# EAGLE design Me-Motor Driver v2.0 (EAGLE 6.2)
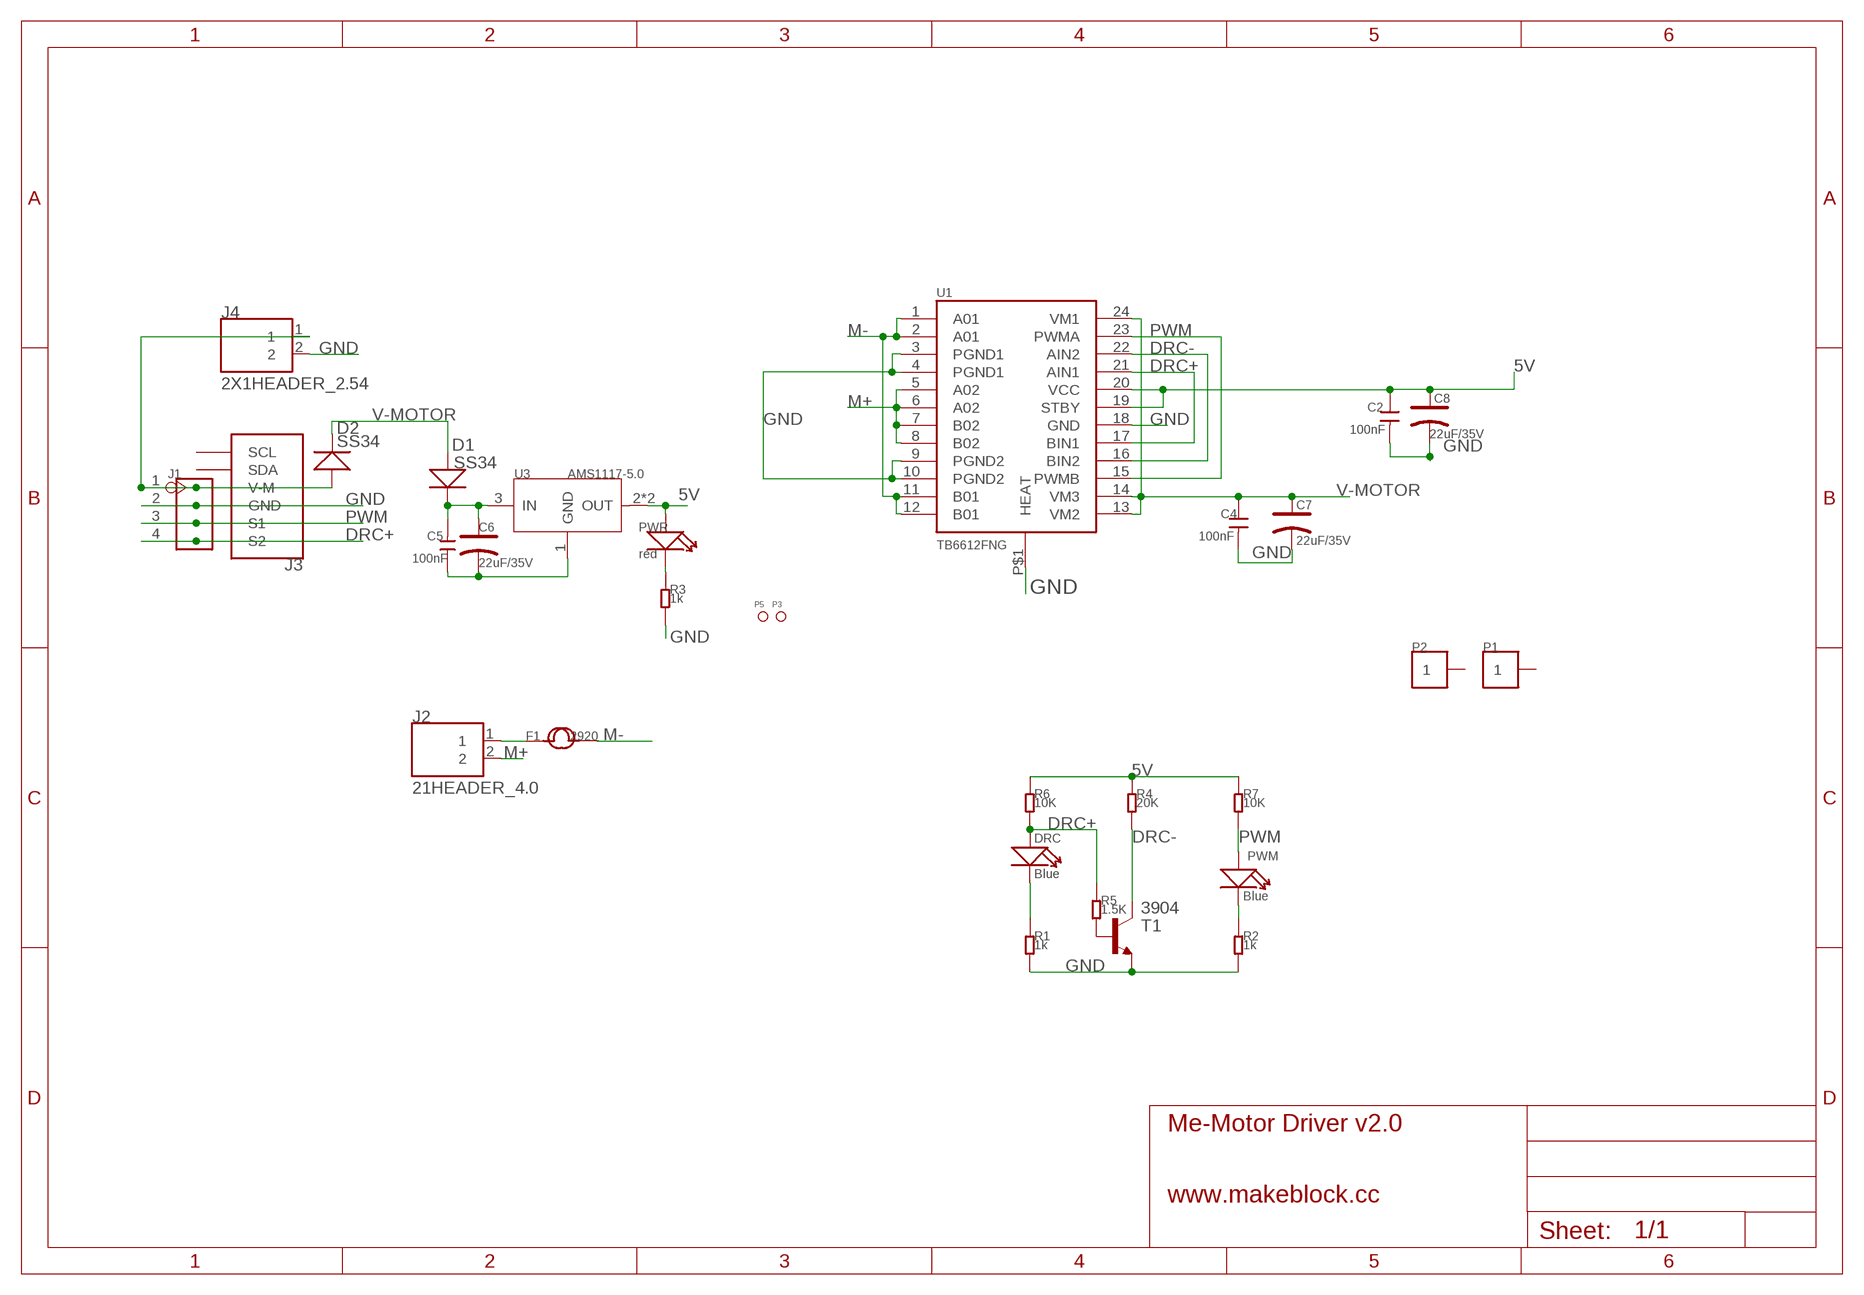
[diagram p0: schematic, sheet 1]

## Parts
C2  100nF  006-C30*35  [0603_S]
C4  100nF  006-C30*35  [0603_S]
C5  100nF  C-0603  [0603]
C6  22uF/35V  CAP-ELECTRO-B  [ELECTRO-SMD-B-4.8MM]
C7  22uF/35V  CAP-ELECTRO-B  [ELECTRO-SMD-B-4.8MM]
C8  22uF/35V  CAP-ELECTRO-B  [ELECTRO-SMD-B-4.8MM]
D1  SS34  D'SMA'  [D2010]
D2  SS34  D'SMA'  [D2010]
DRC  Blue  LED'0603'  [LED-0603]
F1  2920  [2920]
J1  HEADER-4P-60/35MIL  [4P-65/35MIL]
J2  21HEADER_4.0  [2*1HEADER_4.0]
J3  RJ11-6P6C-MOTOR  [RJ11-6P6C]
J4  2X1HEADER_2.54  [2X1HEADER_2.54]
P1  PAD-1P-4MM  [HOLE-01]
P2  PAD-1P-4MM  [HOLE-01]
P3  PAD-MARK  [ROUND-MARK-1.0]
P5  PAD-MARK  [ROUND-MARK-1.0]
PWM  Blue  LED'0603'  [LED-0603]
PWR  red  LED'0603'  [LED-0603]
R1  1k  R-0603  [0603]
R2  1k  R-0603  [0603]
R3  1k  R-0603  [0603]
R4  20K  R-0603  [0603]
R5  1.5K  R-0603  [0603]
R6  10K  R-0603  [0603]
R7  10K  R-0603  [0603]
T1  3904  [3904]
U1  TB6612FNG  [SSOP24]
U3  AMS1117-5.0  LD1117S  [SOT-223]

## Nets
5V: C2.1 C8.+ PWR.+ R4.1 R6.1 R7.1 U1.19(STBY) U1.20(VCC) U3.2(OUT) U3.TER(OUT)
DRC+: DRC.+ J1.4 J3.6(S2) R5.1 R6.2 U1.17(BIN1) U1.21(AIN1)
DRC-: R4.2 T1.3(C) U1.16(BIN2) U1.22(AIN2)
GND: C2.2 C4.2 C5.1 C6.- C7.- C8.- J1.2 J3.4(GND) J4.2 R1.2 R2.2 R3.2 T1.2(E) U1.3(PGND1) U1.4(PGND1) U1.9(PGND2) U1.10(PGND2) U1.18(GND) U1.P$1(HEAT) U3.1(GND)
M+: J2.2 U1.5(A02) U1.6(A02) U1.7(B02) U1.8(B02)
M-: F1.2 U1.1(A01) U1.2(A01) U1.11(B01) U1.12(B01)
N$1: DRC.- R1.1
N$2: F1.1 J2.1
N$3: PWM.- R2.1
N$4: R5.2 T1.1(B)
N$5: PWR.- R3.1
N$6: C5.2 C6.+ D1.- U3.3(IN)
POWER: D2.+ J1.1 J3.3(V-M) J4.1
PWM: J1.3 J3.5(S1) PWM.+ R7.2 U1.15(PWMB) U1.23(PWMA)
V-MOTOR: C4.1 C7.+ D1.+ D2.- U1.13(VM2) U1.14(VM3) U1.24(VM1)
Unconnected: J3.1(SCL) J3.2(SDA) P1.1 P2.1

## Notes on the sheet
- www.makeblock.cc

## Library data of the parts
C2 C4 = Discrete:006-C*: Ceramic Capacitors
C5 = Discrete:C*: Ceramic Capacitors
C6-C8 = Discrete:CAP*: Electrolytic Capacitors,Tantalum Capacitors and Super Capacitors
D1 D2 = Discrete:D*
DRC PWM PWR = Discrete:LED*
F1 = Makeblock:2920
J1 = Connector:HEADER-4P
J2 = Makeblock:2*1HEADER_4.0
J3 = Makeblock:RJ11-6P6C-MOTOR
J4 = Makeblock:2X1HEADER_2.54
P1 P2 = Makeblock:PAD-1P*
P3 P5 = Discrete:PAD-MARK; PARTNO: DNP
R1-R7 = Discrete:R*
T1 = Makeblock:3904
U1 = SparkFun-PowerIC:TB6612FNG: Toshiba 1A dual motor driver
U3 = IC:LD1117: Low Drop Fixed And Adjustable Positive Voltage Regulators http://www.datasheetcatalog.org/datasheet/SGSThomsonMicroelectronics/mXuqtqv.pdf

## Board
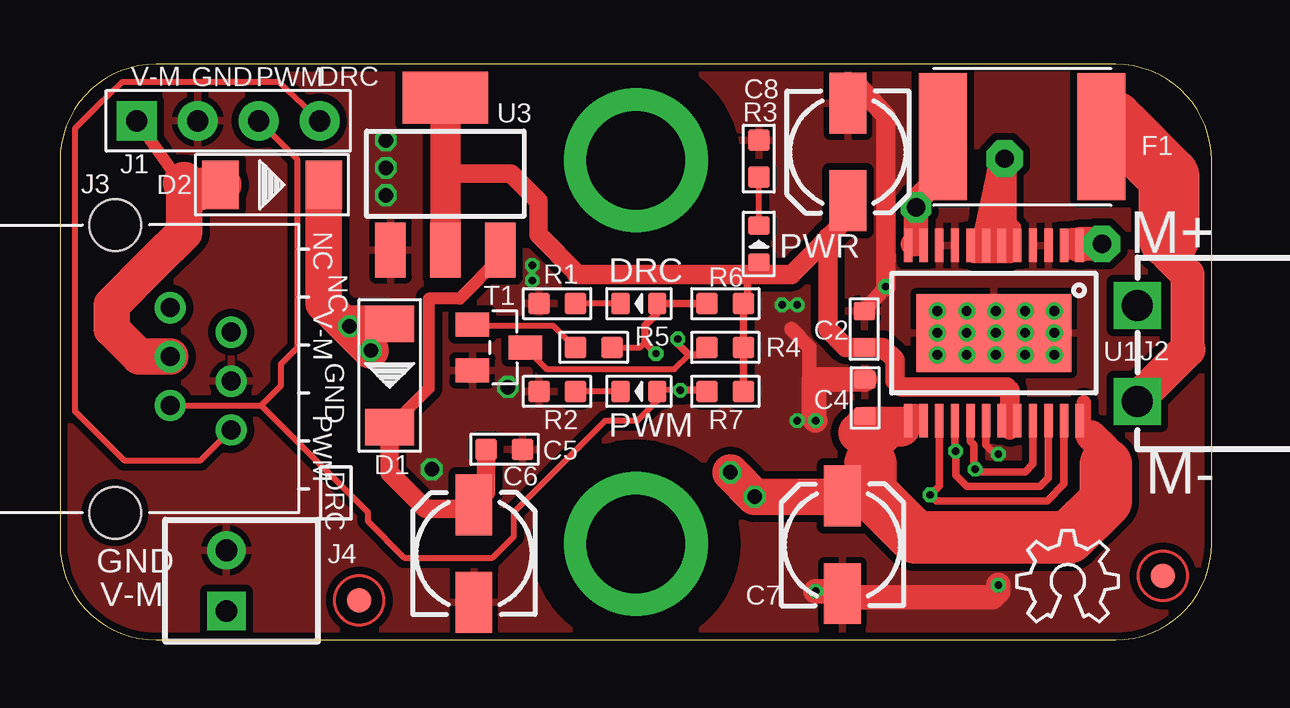
[diagram p1: board, top side]
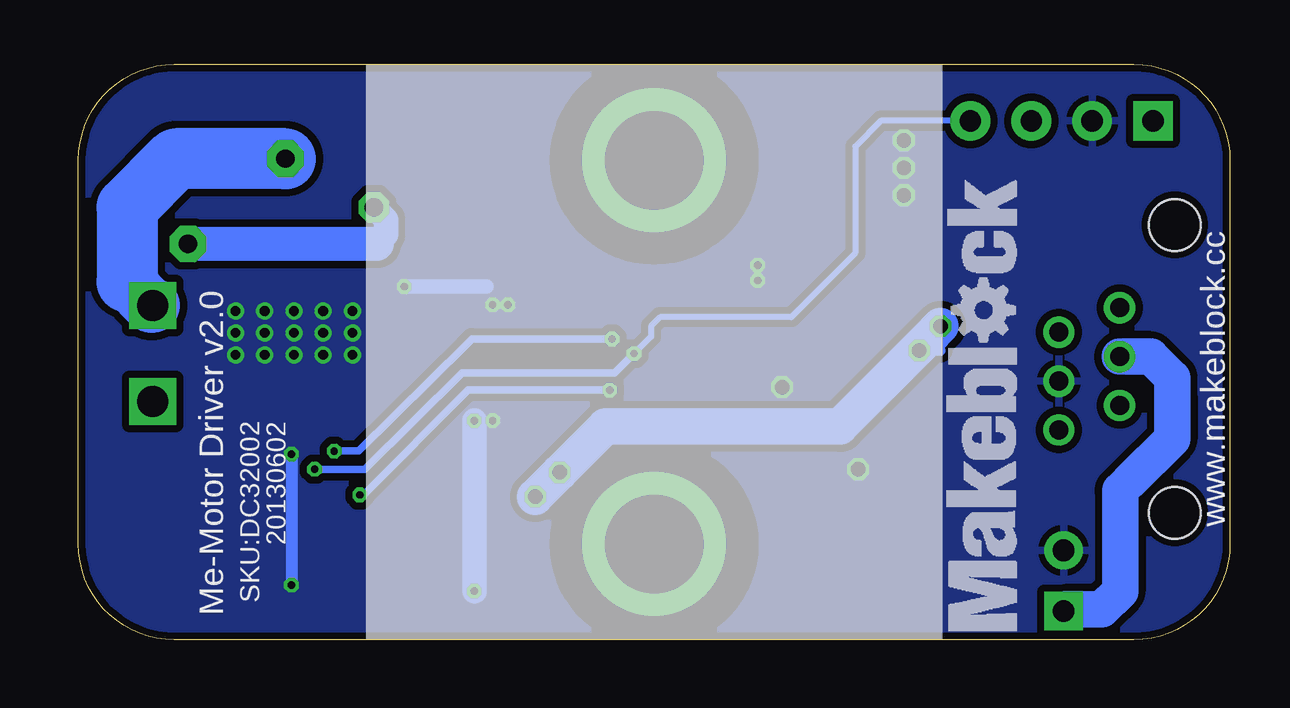
[diagram p2: board, bottom side, seen from below]

Size 48 x 24 mm. Coordinates in mm from the lower left corner, seen from the top.
Outline: 0,20 0,4 arc90 4,0 44,0 arc90 48,4 48,20 arc90 44,24 4,24 arc90 0,20
Copper layers (1*16): Top 0.035mm / dielectric 1.5mm / Bottom 0.035mm
Design rules: minimum track width 6mil, minimum drill 12mil, track to track 8mil, track to pad 8mil, pad to pad 8mil, via to via 8mil, smd to smd 0mil, copper to edge 10mil, drill to drill 10mil, minimum pad ring 10mil, minimum via ring 6mil, stop-mask expansion 2mil, vias tented up to drill 100mil, thermal gap 10mil

### Footprints (pad centres in the part's own frame; a part is rotated, then mirrored left to right if it is on the bottom)
0603_S = smd 0.762 x 0.889: 1 -0.762,0; 2 0.762,0
0603 = smd 0.889 x 0.889: 1 -0.762,0; 2 0.762,0
ELECTRO-SMD-B-4.8MM = smd 2.54 x 1.524: + 2.032,0; - -2.032,0
D2010 = smd 1.524 x 2.032: + -2.159,0; - 2.159,0
LED-0603 = smd 0.762 x 0.889: + -0.762,0; - 0.762,0
2920 = smd 2 x 5.3: 1 -3.3,0; 2 3.3,0
4P-65/35MIL = drill 0.889 pad 1.651 square: 1 0,3.81 | drill 0.889 pad 1.651: 2 0,1.27; 3 0,-1.27; 4 0,-3.81
2*1HEADER_4.0 = drill 1.3 pad 1.95 square: 1 0,-4; 2 0,0
RJ11-6P6C = drill 0.8: 1 -2.55,1.8; 2 -1.53,4.34; 3 -0.51,1.8; 4 0.51,4.34; 5 1.53,1.8; 6 2.55,4.34 | hole 2.15: -6,-0.5; 6,-0.5
2X1HEADER_2.54 = drill 0.9 pad 1.6 square: 1 0,-2.54 | drill 0.9 pad 1.6: 2 0,0
HOLE-01 = drill 4.1 pad 6: 1 0,0
ROUND-MARK-1.0 = smd 1.016 x 1.016: P$1 0,0
3904 = smd 1 x 1.4: 1 -0.95,-1.1; 2 0.95,-1.1; 3 0,1.1
SSOP24 = smd 0.348 x 1.397: 1 -3.575,-3.656; 2 -2.925,-3.656; 3 -2.275,-3.656; 4 -1.625,-3.656; 5 -0.975,-3.656; 6 -0.325,-3.656; 7 0.325,-3.656; 8 0.975,-3.656; 9 1.625,-3.656; 10 2.275,-3.656; 11 2.925,-3.656; 12 3.575,-3.656; 13 3.575,3.656; 14 2.925,3.656; 15 2.275,3.656; 16 1.625,3.656; 17 0.975,3.656; 18 0.325,3.656; 19 -0.325,3.656; 20 -0.975,3.656; 21 -1.625,3.656; 22 -2.275,3.656; 23 -2.925,3.656; 24 -3.575,3.656 | smd 6.452 x 3.251: P$1 0,0
SOT-223 = smd 1.27 x 2.286: 1 -2.286,-3.175; 2 0,-3.175; 3 2.286,-3.175 | smd 3.556 x 2.159: TER 0,3.175

### Placement (x,y rotation side)
C2  33.53,12.95 90 top
C4  33.55,10.09 90 top
C5  18.53,7.95 180 top
C6  17.26,3.6 90 top
C7  32.61,3.96 90 top
C8  32.84,20.35 270 top
D1  13.74,11.02 270 top
D2  8.84,18.97 0 top
DRC  24.13,14.02 180 top
F1  40.11,20.98 180 top
J1  7.01,21.64 90 top
J2  44.91,13.94 0 top
J3  2.79,11.3 270 top
J4  6.93,3.73 0 top
P1  24,20 0 top
P2  24,4 0 top
P3  45.97,2.67 0 top
P5  12.47,1.65 0 top
PWM  24.13,10.36 180 top
PWR  29.13,16.51 90 top
R1  20.73,14.02 180 top
R2  20.73,10.36 180 top
R3  29.13,20.07 90 top
R4  27.74,12.19 180 top
R5  22.25,12.19 180 top
R6  27.74,14.02 180 top
R7  27.74,10.36 180 top
T1  18.29,12.19 270 top
U1  38.93,12.79 180 top
U3  16.07,19.44 0 top
U$1  [OSHW_6X150_NOTEXT]  39.88,0.76 0 top
U$2  [LOGO-3/2]  8.88,0.36 90 bottom

### Tracks (layer width: path | path; a pad name or v marks a point on that pad's centre or on a via)
5V
  Top 0.254: 32,16.79 32,17.07 32.84,17.91 | PWR.+ 28.93,15.34 28.83,15.24
  Top 0.305: U1.20 39.9,9.06 39.6,8.76 39.6,8.79 U1.19 | R7.1 R4.1 R6.1 28.65,14.17 28.65,15.24
  Top 0.406: 27.56,15.12 27.69,15.24
  Top 0.762: 21.54,15.24 21.54,15.29 19.94,16.89 19.94,18.29 18.8,19.43 16.07,19.43
  Top 0.813: 39.6,8.76 39.6,10.41 39.47,10.54 35.08,10.54 34.8,10.82 34.8,11.68 34.29,12.19 C2.1 32.77,12.19 32,12.95 32,16.79 | 21.54,15.24 27.69,15.24 28.65,15.24 28.83,15.24 30.48,15.24 32.84,17.6 32.84,17.91 C8.+
  Top 1.27: U3.2 16.07,19.43 U3.TER
DRC+  (via drill 0.3)
  Top 0.254: R5.1 24.18,12.19 24.38,12.39 | J1.4 9.09,23.27 2.62,23.27 1.52,22.23 0.64,21.34 0.64,9.53 0.76,9.4 0.89,9.27 1.02,9.14 2.67,7.49 5.87,7.49 J3.6
  Top 0.305: U1.17 37.95,8.28 38.1,8.13 38.1,7.37 | 38.1,7.37 v38.15,7.11 | U1.21 40.55,7.33 40.23,7.01 38.41,7.01 38.1,7.32 38.1,7.37 | R6.2 DRC.+ 24.89,13.61 24.38,13.11 24.38,12.39 v24.84,11.94
  Bottom 0.254: 24.71,11.81 v24.84,11.94 24.13,12.65 24.13,13.08 23.75,13.46 18.29,13.46 15.62,16.13 15.62,20.57 14.55,21.64 J1.4
  Bottom 0.305: v38.15,7.11 36.07,7.11 32,11.12 25.65,11.12 v24.84,11.94
DRC-  (via drill 0.3)
  Top 0.254: 26.21,11.89 25.6,11.28 20.3,11.28 T1.3
  Top 0.305: U1.16 37.3,7.91 v37.34,7.87 37.34,6.86 37.8,6.4 40.84,6.4 41.2,6.76 U1.22 | R4.2 26.67,11.89 26.21,11.89 25.76,12.34 v25.76,12.55
  Bottom 0.305: v37.34,7.87 36.32,7.87 31.83,12.32 31.6,12.55 v25.76,12.55
GND  (via drill 0.3, 0.41, 0.6)
  Top 0.305: U1.18 38.6,8.13 39.12,7.62 | 31.24,12.19 31.24,9.4 v31.5,9.14
  Top 0.61: C2.2 v34.42,14.73 | 30.48,12.95 31.24,12.19 31.24,10.92 31.43,10.86
  Top 0.813: 33.27,23.11 34.42,21.84 v34.42,14.73
  Top 1.016: v39.12,2.29 39.12,2.03 38.86,1.78 33.4,1.78 | C4.2 31.43,10.86 31.43,9.21 v31.5,9.14 | v31.5,2.03 32.89,2.03
  Bottom 0.508: 39.12,7.62 v39.12,2.29
  Bottom 0.61: v34.42,14.73 30.99,14.73
  Bottom 1.016: v31.5,9.14 v31.5,2.03
  other vias: 36.58,13.72 36.58,12.8 36.58,11.89 37.8,13.72 39.01,13.72 40.23,13.72 41.45,13.72 37.8,12.8 37.8,11.89 39.01,12.8 39.01,11.89 40.23,11.89 40.23,12.8 41.45,12.8 41.45,11.89 39.12,7.75 13.59,20.83 13.59,19.68 13.59,18.54 15.49,7.11 18.67,10.54 30.73,9.14 19.68,14.99 19.68,15.62 30.73,13.97 30.1,13.97
  pour Top (isolate 0.305): 0,24.08 48.16,24.08 48.16,0 0,0
  pour Bottom (isolate 0.305): 0,24.08 47.85,24.08 47.85,0 0,0
M+  (via drill 0.76 pad 1.52)
  Top 0.305: U1.8 37.95,16.15 38.1,16 | U1.6 U1.5 39.9,17.25 39.62,17.53 39.37,17.27
  Top 0.61: 38.1,16 39.62,16 39.62,16.51 39.62,16.89 | U1.7 U1.6
  Top 0.813: v39.37,20.07 39.37,16.76 39.62,16.51
  Top 1.016: 39.37,17.27 v39.37,20.07
  Top 1.27: U1.7 39.11,18.79 v39.37,20.07
  Bottom 2.286: J2.2 44.98,13.95 45.97,14.94
  Bottom 2.54: v39.37,20.07 43.94,20.07 45.97,18.03 45.97,14.94
M-  (via drill 0.76 pad 1.27, 0.76 pad 1.52)
  Top 0.254: U1.11 U1.12 35.35,16.55 35.43,16.64 35.43,18.03 36.7,19.3 36.7,20.95
  Top 0.305: U1.2 41.85,16.7 42.16,17.02 42.42,17.02 42.42,16 42.05,16 | 41.91,16 42.05,16 | 42.05,16 U1.1
  Top 1.016: 35.56,16.51 35.69,16.51 v35.69,18.03 35.69,18.29 36.7,19.3
  Top 1.27: U1.1 42.5,16.43
  Top 1.422: v43.43,16.51 42.56,16.51 U1.1
  Top 1.524: 36.7,20.95 36.78,20.95 F1.2
  Bottom 1.016: 35.56,16.51 35.18,16.89 35.18,17.53 v35.69,18.03
  Bottom 1.422: 35.56,16.51 v43.43,16.51
N$1
  Top 0.254: DRC.- R1.1
N$2
  Top 0.813: 43.89,21.03 44.2,21.34
  Top 1.422: 46.23,16.76 46.23,16 46.99,15.24 46.99,12.11
  Top 1.524: 43.87,21.62 43.87,21.44 F1.1 | J2.1 44.91,10.03 46.99,12.11
  Top 2.54: 46.23,16.76 46.23,19.3 44.2,21.34 43.89,21.64 43.87,21.62
N$3
  Top 0.254: PWM.- R2.1
N$4
  Top 0.254: R5.2 21.46,12.19 20.57,13.08 17.25,13.08 T1.1
N$5
  Top 0.254: PWR.- R3.1
N$6
  Top 0.508: U3.3 18.35,15.94 16.66,14.22 15.39,14.22 15.37,14.22 15.37,10.49 D1.-
  Top 0.762: D1.- 13.74,6.96 15.24,5.46 17.08,5.46 C6.+ 17.76,6.14 C5.2
POWER
  Top 0.254: J3.3
  Top 0.508: 5.18,19.05 4.72,19.51 J1.1
  Top 1.524: 5.18,19.05 5.18,16.99 3.94,15.75 2.16,13.97 2.16,12.95 3.3,11.81 J3.3
  Top 1.778: D2.+ 5.51,18.72 5.18,19.05
  Bottom 1.524: J4.1 6.86,1.27 5.33,1.27 4.57,2.03 4.57,6.22 4.19,6.6 2.41,8.38 2.41,10.16 2.41,10.92 3.3,11.81 J3.3
PWM  (via drill 0.3)
  Top 0.254: v25.86,10.41 24.97,10.41 PWM.+ 24.89,9.96 24.08,9.14 22.73,9.14 18.92,5.33 18.92,4.32 18.03,3.43 14.35,3.43 12.83,4.95 12.83,5.33 8.39,9.77 | J1.3 9.91,20.02 9.91,12.19 9.2,11.49 9.2,10.59 8.39,9.77 | J3.5 8.13,9.77 8.39,9.77
  Top 0.305: U1.15 36.65,6.42 v36.27,6.04 36.52,5.79 41.15,5.79 41.85,6.49 U1.23 | v25.86,10.41 26.77,10.41 R7.2
  Bottom 0.305: v25.86,10.41 31.75,10.41 36.12,6.04 v36.27,6.04
V-MOTOR  (via drill 0.6)
  Top 0.254: U1.24 42.5,9.53 arc-45 42.65,9.88 42.67,9.91 | 42.98,8.53 42.88,8.43
  Top 0.305: U1.13 35.55,9.14 | 35.55,9.14 35.56,9.14 | 35.55,9.14 U1.14
  Top 0.406: 32.77,5.33 32.61,5.33 C7.+
  Top 0.61: 42.67,9.91 42.67,8.64 42.88,8.43 42.93,8.38 | 35.05,8.89 35.05,8.94 35.66,9.55 35.66,9.45 U1.13 | 34.03,9.14 33.78,8.89 | 34.04,5.33 32.77,5.33 33.55,6.12 C4.1 33.53,9.31 33.53,8.89 | 35.55,9.14 33.78,7.37
  Top 1.27: 43.59,7.32 43.59,7.92 42.98,8.53
  Top 1.524: D2.- 11,14.02 v12.95,12.06 | C7.+ 32.59,5.97 v28.96,5.97 v27.94,6.99 | D1.+ 12.17,13.18 v12.06,13.08
  Top 1.676: 33.27,8.64 33.53,8.89 33.78,8.89 35.05,8.89
  Top 2.184: 33.78,7.37 33.78,6.15 35.66,4.27 42.06,4.27 43.59,5.79 43.59,7.32
  Bottom 0.406: v12.95,12.06 12.06,12.06 v12.06,13.08
  Bottom 1.524: 12.57,12.57 v12.06,13.08 16.26,8.89 26.04,8.89 v27.94,6.99 v28.96,5.97

### Text on the board
tPlace: V-M | GND | PWM | DRC | M+ | NC | NC | V-M | GND | PWM | M- | DRC | GND | V-M
bPlace: 20130602 | SKU:DC32002 | www.makeblock.cc | Me-Motor Driver v2.0